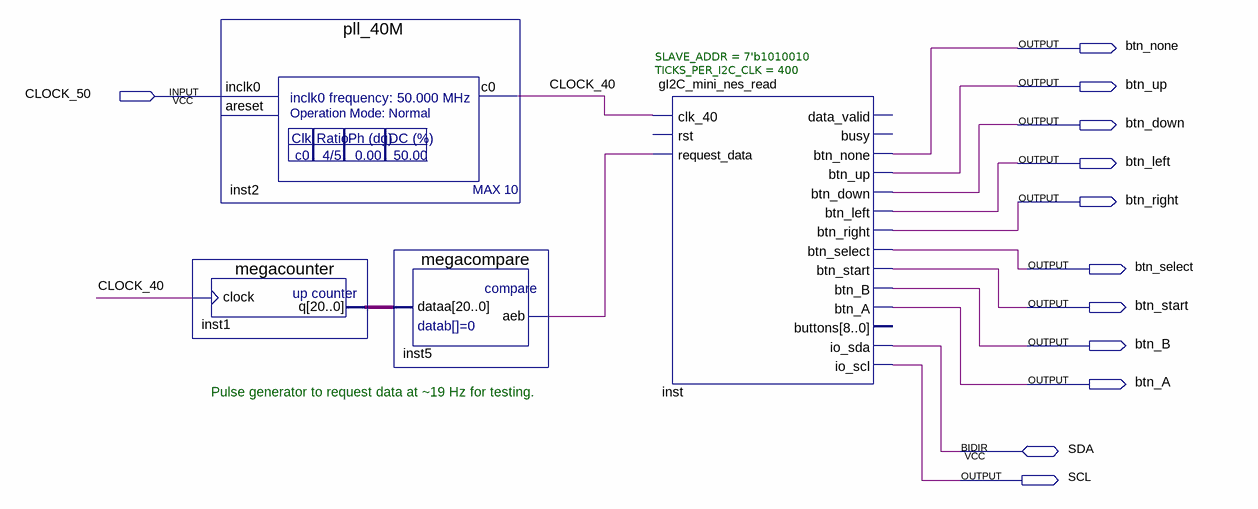
[diagram p0: schematic sheet]
// Quartus schematic top_level.bdf as structural Verilog: 4 symbols, 12 pins
module top_level (
  input  CLOCK_50,
  inout  SDA,
  output btn_none,
  output btn_up,
  output btn_down,
  output btn_left,
  output btn_right,
  output btn_select,
  output btn_start,
  output btn_B,
  output btn_A,
  output SCL
);

  wire CLOCK_40, inst5_aeb;
  wire [20:0] inst1_q;

  megacounter inst1 (.clock(CLOCK_40), .q(inst1_q));
  pll_40M inst2 (.inclk0(CLOCK_50), .c0(CLOCK_40));  // open: areset
  megacompare inst5 (.dataa(inst1_q), .aeb(inst5_aeb));
  gI2C_mini_nes_read #(.SLAVE_ADDR(7'b1010010), .TICKS_PER_I2C_CLK(400)) inst (
    .clk_40(CLOCK_40), .request_data(inst5_aeb), .btn_none(btn_none), .btn_up(btn_up), .btn_down(btn_down),
    .btn_left(btn_left), .btn_right(btn_right), .btn_select(btn_select), .btn_start(btn_start),
    .btn_B(btn_B), .btn_A(btn_A), .io_sda(SDA), .io_scl(SCL));  // open: rst, data_valid, busy, buttons

  // Notes on the sheet:
  //   Pulse generator to request data at ~19 Hz for testing.
endmodule
